# EasyEDA schematic dron_shm.json
TITLE: Drone; REV: 1.0; Date: 2025; Sheet: 1/1; Company: MIPT-DREC
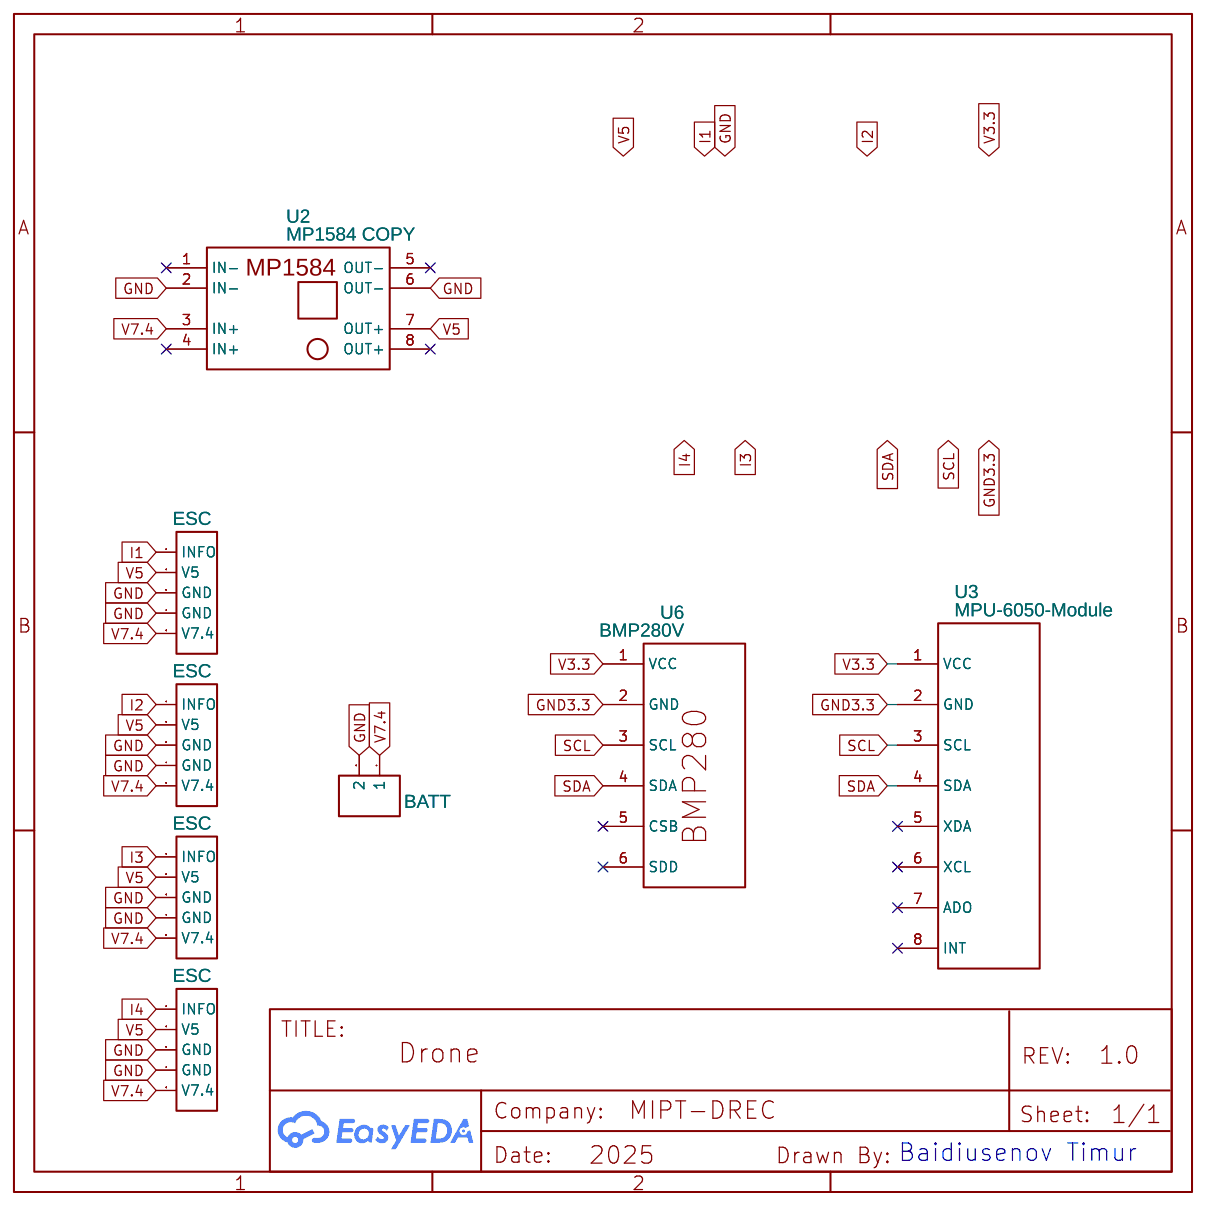
[diagram p0: schematic sheet]

## Parts
ECS1  ESC  [HDR-F-2.54_1X5]
ECS2  ESC  [HDR-F-2.54_1X5]
ECS3  ESC  [HDR-F-2.54_1X5]
ECS4  ESC  [HDR-F-2.54_1X5]
H1  BATT  [HDR-F-2.54_1X2]
U2  MP1584 COPY  [MP1584EN]
U3  MPU-6050-Module  [MPU-6050-MODULE]
U6  BMP280V  [BMP280V]

## Library data of the parts
ECS1-ECS4 = HDR-F-2.54_1x5: Supplier Part: C50950; Supplier: LCSC; Contributor: LCEDA_Lib
H1 = HDR-F-2.54_1x2: Supplier Part: C49661; Supplier: LCSC; Contributor: LCEDA_Lib
U2 = MP1584 COPY: Contributor: johnnyCh
U3 = MPU-6050-Module: Contributor: thibaud.silvestre
U6 = BMP280V: Contributor: jaouad.arkine

## Nets
GND: ECS1.3(GND) ECS1.4(GND) ECS2.3(GND) ECS2.4(GND) ECS3.3(GND) ECS3.4(GND) ECS4.3(GND) ECS4.4(GND) H1.2 U2.2(IN-) U2.6(OUT-)
GND3.3: U3.2(GND) U6.2(GND)
V3.3: U3.1(VCC) U6.1(VCC)
V5: ECS1.2(V5) ECS2.2(V5) ECS3.2(V5) ECS4.2(V5) U2.7(OUT+)
V7.4: ECS1.5(V7.4) ECS2.5(V7.4) ECS3.5(V7.4) ECS4.5(V7.4) H1.1 U2.3(IN+)
I1: ECS4.1(INFO)
I2: ECS1.1(INFO)
I3: ECS2.1(INFO)
I4: ECS3.1(INFO)
SCL: U3.3(SCL) U6.3(SCL)
SDA: U3.4(SDA) U6.4(SDA)

Not connected (* = marked no-connect by the designer): U2 1(IN-)* 4(IN+)* 5(OUT-)* 8(OUT+)*; U3 5(XDA)* 6(XCL)* 7(ADO)* 8(INT)*; U6 5(CSB)* 6(SDD)*

## Notes on the sheet
- Baidiusenov Timur
